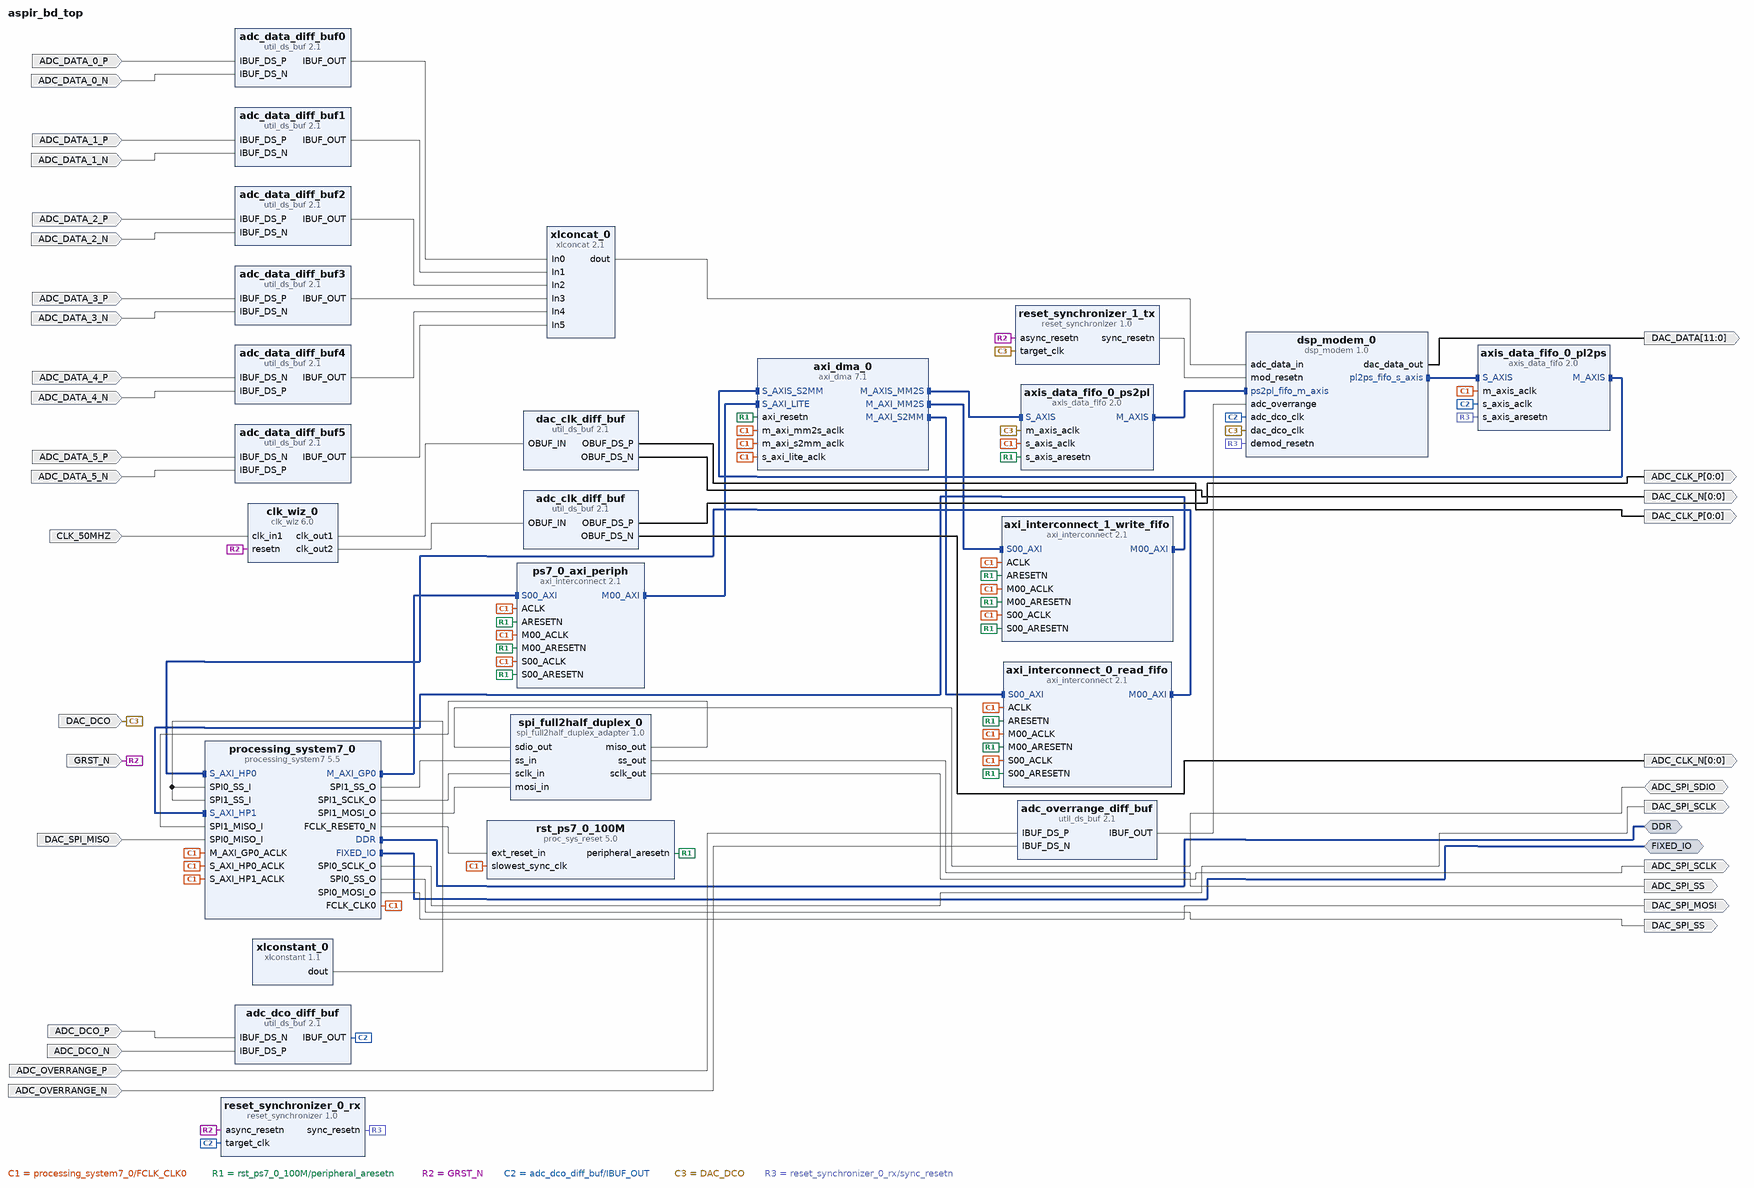
[diagram p0: block diagram of the top level]
# Vivado block design aspir_bd_top, xc7z020clg400-2, Vivado 2019.1
create_bd_design aspir_bd_top

create_bd_intf_port -mode Master -vlnv xilinx.com:interface:ddrx_rtl:1.0 DDR
create_bd_intf_port -mode Master -vlnv xilinx.com:display_processing_system7:fixedio_rtl:1.0 FIXED_IO
create_bd_port -dir O -type clk DAC_SPI_SCLK
create_bd_port -dir O DAC_SPI_SS
create_bd_port -dir O -type data DAC_SPI_MOSI
create_bd_port -dir I -type data DAC_SPI_MISO
create_bd_port -dir O -type clk ADC_SPI_SCLK
create_bd_port -dir O ADC_SPI_SS
create_bd_port -dir IO -type data ADC_SPI_SDIO
create_bd_port -dir I -type data ADC_OVERRANGE_P
create_bd_port -dir I -type data ADC_OVERRANGE_N
create_bd_port -dir I -type rst GRST_N
create_bd_port -dir I -type clk ADC_DCO_P
set_property -dict {CONFIG.FREQ_HZ 250000000} [get_bd_ports ADC_DCO_P]
create_bd_port -dir I -type clk ADC_DCO_N
set_property -dict {CONFIG.FREQ_HZ 250000000} [get_bd_ports ADC_DCO_N]
create_bd_port -dir I -type clk CLK_50MHZ
set_property -dict {CONFIG.ASSOCIATED_RESET GRST_N CONFIG.FREQ_HZ 50000000} [get_bd_ports CLK_50MHZ]
create_bd_port -dir O -from 0 -to 0 -type clk ADC_CLK_P
create_bd_port -dir O -from 0 -to 0 -type clk ADC_CLK_N
create_bd_port -dir O -from 0 -to 0 -type clk DAC_CLK_N
create_bd_port -dir O -from 0 -to 0 -type clk DAC_CLK_P
create_bd_port -dir O -from 11 -to 0 -type data DAC_DATA
create_bd_port -dir I -type clk DAC_DCO
set_property -dict {CONFIG.FREQ_HZ 250000000} [get_bd_ports DAC_DCO]
create_bd_port -dir I -type data ADC_DATA_0_P
create_bd_port -dir I -type data ADC_DATA_0_N
create_bd_port -dir I -type data ADC_DATA_1_P
create_bd_port -dir I -type data ADC_DATA_2_P
create_bd_port -dir I -type data ADC_DATA_3_P
create_bd_port -dir I -type data ADC_DATA_4_P
create_bd_port -dir I -type data ADC_DATA_5_P
create_bd_port -dir I -type data ADC_DATA_1_N
create_bd_port -dir I -type data ADC_DATA_2_N
create_bd_port -dir I -type data ADC_DATA_3_N
create_bd_port -dir I -type data ADC_DATA_4_N
create_bd_port -dir I -type data ADC_DATA_5_N

create_bd_cell -type ip -vlnv xilinx.com:ip:processing_system7:5.5 processing_system7_0
set_property -dict [list \
  CONFIG.PCW_APU_PERIPHERAL_FREQMHZ 767 \
  CONFIG.PCW_ENET0_ENET0_IO {MIO 16 .. 27} \
  CONFIG.PCW_ENET0_GRP_MDIO_ENABLE 1 \
  CONFIG.PCW_ENET0_GRP_MDIO_IO {MIO 52 .. 53} \
  CONFIG.PCW_ENET0_PERIPHERAL_ENABLE 1 \
  CONFIG.PCW_ENET0_RESET_ENABLE 1 \
  CONFIG.PCW_ENET0_RESET_IO {MIO 7} \
  CONFIG.PCW_ENET_RESET_ENABLE 1 \
  CONFIG.PCW_ENET_RESET_SELECT {Share reset pin} \
  CONFIG.PCW_FCLK_CLK0_BUF FALSE \
  CONFIG.PCW_FPGA0_PERIPHERAL_FREQMHZ 100 \
  CONFIG.PCW_GPIO_EMIO_GPIO_ENABLE 1 \
  CONFIG.PCW_GPIO_EMIO_GPIO_IO 3 \
  CONFIG.PCW_GPIO_EMIO_GPIO_WIDTH 3 \
  CONFIG.PCW_GPIO_MIO_GPIO_ENABLE 1 \
  CONFIG.PCW_GPIO_MIO_GPIO_IO MIO \
  CONFIG.PCW_I2C_RESET_ENABLE 0 \
  CONFIG.PCW_PRESET_BANK1_VOLTAGE {LVCMOS 1.8V} \
  CONFIG.PCW_QSPI_GRP_FBCLK_ENABLE 1 \
  CONFIG.PCW_QSPI_GRP_FBCLK_IO {MIO 8} \
  CONFIG.PCW_QSPI_GRP_SINGLE_SS_ENABLE 1 \
  CONFIG.PCW_QSPI_GRP_SINGLE_SS_IO {MIO 1 .. 6} \
  CONFIG.PCW_QSPI_PERIPHERAL_ENABLE 1 \
  CONFIG.PCW_QSPI_QSPI_IO {MIO 1 .. 6} \
  CONFIG.PCW_SD0_PERIPHERAL_ENABLE 0 \
  CONFIG.PCW_SINGLE_QSPI_DATA_MODE x4 \
  CONFIG.PCW_SPI0_PERIPHERAL_ENABLE 1 \
  CONFIG.PCW_SPI0_SPI0_IO EMIO \
  CONFIG.PCW_SPI1_PERIPHERAL_ENABLE 1 \
  CONFIG.PCW_SPI1_SPI1_IO EMIO \
  CONFIG.PCW_S_AXI_HP0_DATA_WIDTH 32 \
  CONFIG.PCW_UART0_PERIPHERAL_ENABLE 1 \
  CONFIG.PCW_UART0_UART0_IO {MIO 46 .. 47} \
  CONFIG.PCW_UART1_PERIPHERAL_ENABLE 0 \
  CONFIG.PCW_UART_PERIPHERAL_FREQMHZ 100 \
  CONFIG.PCW_UIPARAM_DDR_FREQ_MHZ 533.333 \
  CONFIG.PCW_UIPARAM_DDR_PARTNO {MT41J128M8 JP-125} \
  CONFIG.PCW_USB0_PERIPHERAL_ENABLE 0 \
  CONFIG.PCW_USB_RESET_ENABLE 1 \
  CONFIG.PCW_USE_S_AXI_HP0 1 \
  CONFIG.PCW_USE_S_AXI_HP1 1 \
] [get_bd_cells processing_system7_0]
# 255 more settings of processing_system7_0 are not shown: defaults, MIO pin electricals, DDR timing, and values the tool derives
create_bd_cell -type ip -vlnv xilinx.com:ip:clk_wiz:6.0 clk_wiz_0
set_property -dict [list \
  CONFIG.CLKIN1_JITTER_PS 200.0 \
  CONFIG.CLKOUT1_DRIVES BUFG \
  CONFIG.CLKOUT1_JITTER 136.987 \
  CONFIG.CLKOUT1_PHASE_ERROR 164.985 \
  CONFIG.CLKOUT1_REQUESTED_OUT_FREQ 250.000 \
  CONFIG.CLKOUT2_DRIVES BUFG \
  CONFIG.CLKOUT2_JITTER 136.987 \
  CONFIG.CLKOUT2_PHASE_ERROR 164.985 \
  CONFIG.CLKOUT2_REQUESTED_OUT_FREQ 250.000 \
  CONFIG.CLKOUT2_USED true \
  CONFIG.CLKOUT3_DRIVES BUFG \
  CONFIG.CLKOUT4_DRIVES BUFG \
  CONFIG.CLKOUT5_DRIVES BUFG \
  CONFIG.CLKOUT6_DRIVES BUFG \
  CONFIG.CLKOUT7_DRIVES BUFG \
  CONFIG.FEEDBACK_SOURCE FDBK_AUTO \
  CONFIG.MMCM_BANDWIDTH OPTIMIZED \
  CONFIG.MMCM_CLKFBOUT_MULT_F 20.000 \
  CONFIG.MMCM_CLKIN1_PERIOD 20.000 \
  CONFIG.MMCM_CLKIN2_PERIOD 10.0 \
  CONFIG.MMCM_CLKOUT0_DIVIDE_F 4.000 \
  CONFIG.MMCM_CLKOUT1_DIVIDE 4 \
  CONFIG.MMCM_COMPENSATION ZHOLD \
  CONFIG.NUM_OUT_CLKS 2 \
  CONFIG.PRIMITIVE MMCM \
  CONFIG.PRIM_IN_FREQ 50 \
  CONFIG.RESET_PORT resetn \
  CONFIG.RESET_TYPE ACTIVE_LOW \
] [get_bd_cells clk_wiz_0]
create_bd_cell -type ip -vlnv xilinx.com:ip:util_ds_buf:2.1 adc_overrange_diff_buf
create_bd_cell -type ip -vlnv xilinx.com:ip:util_ds_buf:2.1 adc_dco_diff_buf
create_bd_cell -type ip -vlnv xilinx.com:ip:util_ds_buf:2.1 dac_clk_diff_buf
set_property -dict {CONFIG.C_BUF_TYPE OBUFDS} [get_bd_cells dac_clk_diff_buf]
create_bd_cell -type ip -vlnv xilinx.com:ip:util_ds_buf:2.1 adc_clk_diff_buf
set_property -dict {CONFIG.C_BUF_TYPE OBUFDS} [get_bd_cells adc_clk_diff_buf]
create_bd_cell -type ip -vlnv xilinx.com:ip:util_ds_buf:2.1 adc_data_diff_buf1
set_property -dict {CONFIG.C_SIZE 1} [get_bd_cells adc_data_diff_buf1]
create_bd_cell -type ip -vlnv xilinx.com:ip:util_ds_buf:2.1 adc_data_diff_buf2
set_property -dict {CONFIG.C_SIZE 1} [get_bd_cells adc_data_diff_buf2]
create_bd_cell -type ip -vlnv xilinx.com:ip:util_ds_buf:2.1 adc_data_diff_buf3
set_property -dict {CONFIG.C_SIZE 1} [get_bd_cells adc_data_diff_buf3]
create_bd_cell -type ip -vlnv xilinx.com:ip:util_ds_buf:2.1 adc_data_diff_buf4
set_property -dict {CONFIG.C_SIZE 1} [get_bd_cells adc_data_diff_buf4]
create_bd_cell -type ip -vlnv xilinx.com:ip:util_ds_buf:2.1 adc_data_diff_buf5
set_property -dict {CONFIG.C_SIZE 1} [get_bd_cells adc_data_diff_buf5]
create_bd_cell -type ip -vlnv xilinx.com:ip:xlconcat:2.1 xlconcat_0
set_property -dict {CONFIG.NUM_PORTS 6} [get_bd_cells xlconcat_0]
create_bd_cell -type ip -vlnv xilinx.com:ip:util_ds_buf:2.1 adc_data_diff_buf0
set_property -dict {CONFIG.C_SIZE 1} [get_bd_cells adc_data_diff_buf0]
create_bd_cell -type ip -vlnv xilinx.com:ip:axi_dma:7.1 axi_dma_0
set_property -dict {CONFIG.c_include_sg 0} [get_bd_cells axi_dma_0]
create_bd_cell -type ip -vlnv xilinx.com:ip:axis_data_fifo:2.0 axis_data_fifo_0_ps2pl
set_property -dict [list \
  CONFIG.FIFO_MEMORY_TYPE block \
  CONFIG.HAS_TKEEP 1 \
  CONFIG.HAS_TLAST 1 \
  CONFIG.HAS_TSTRB 0 \
  CONFIG.IS_ACLK_ASYNC 1 \
  CONFIG.TDATA_NUM_BYTES 4 \
  CONFIG.TDEST_WIDTH 0 \
  CONFIG.TID_WIDTH 0 \
  CONFIG.TUSER_WIDTH 0 \
] [get_bd_cells axis_data_fifo_0_ps2pl]
create_bd_cell -type ip -vlnv xilinx.com:ip:proc_sys_reset:5.0 rst_ps7_0_100M
create_bd_cell -type ip -vlnv xilinx.com:ip:axi_interconnect:2.1 ps7_0_axi_periph
set_property -dict {CONFIG.NUM_MI 1} [get_bd_cells ps7_0_axi_periph]
create_bd_cell -type ip -vlnv xilinx.com:ip:axis_data_fifo:2.0 axis_data_fifo_0_pl2ps
set_property -dict [list \
  CONFIG.FIFO_MEMORY_TYPE block \
  CONFIG.HAS_TKEEP 1 \
  CONFIG.HAS_TLAST 1 \
  CONFIG.HAS_TSTRB 0 \
  CONFIG.IS_ACLK_ASYNC 1 \
  CONFIG.TDATA_NUM_BYTES 4 \
  CONFIG.TDEST_WIDTH 0 \
  CONFIG.TID_WIDTH 0 \
  CONFIG.TUSER_WIDTH 0 \
] [get_bd_cells axis_data_fifo_0_pl2ps]
create_bd_cell -type ip -vlnv xilinx.com:ip:xlconstant:1.1 xlconstant_0
create_bd_cell -type ip -vlnv xilinx.com:user:reset_synchronizer:1.0 reset_synchronizer_0_rx
create_bd_cell -type ip -vlnv xilinx.com:user:reset_synchronizer:1.0 reset_synchronizer_1_tx
create_bd_cell -type ip -vlnv xilinx.com:ip:axi_interconnect:2.1 axi_interconnect_0_read_fifo
set_property -dict [list \
  CONFIG.NUM_MI 1 \
  CONFIG.NUM_SI 1 \
  CONFIG.S00_HAS_DATA_FIFO 2 \
  CONFIG.S01_HAS_DATA_FIFO 2 \
  CONFIG.S02_HAS_DATA_FIFO 2 \
  CONFIG.STRATEGY 0 \
] [get_bd_cells axi_interconnect_0_read_fifo]
create_bd_cell -type ip -vlnv xilinx.com:ip:axi_interconnect:2.1 axi_interconnect_1_write_fifo
set_property -dict {CONFIG.NUM_MI 1} [get_bd_cells axi_interconnect_1_write_fifo]
create_bd_cell -type ip -vlnv xilinx.com:user:spi_full2half_duplex_adapter:1.0 spi_full2half_duplex_0
create_bd_cell -type ip -vlnv xilinx.com:user:dsp_modem:1.0 dsp_modem_0

# ---- connections ----

connect_bd_intf_net [get_bd_intf_pins axi_dma_0/M_AXIS_MM2S] [get_bd_intf_pins axis_data_fifo_0_ps2pl/S_AXIS]
connect_bd_intf_net [get_bd_intf_pins axis_data_fifo_0_pl2ps/M_AXIS] [get_bd_intf_pins axi_dma_0/S_AXIS_S2MM]
connect_bd_intf_net [get_bd_intf_pins processing_system7_0/M_AXI_GP0] [get_bd_intf_pins ps7_0_axi_periph/S00_AXI]
connect_bd_intf_net [get_bd_intf_pins dsp_modem_0/ps2pl_fifo_m_axis] [get_bd_intf_pins axis_data_fifo_0_ps2pl/M_AXIS]
connect_bd_intf_net [get_bd_intf_pins axi_dma_0/M_AXI_S2MM] [get_bd_intf_pins axi_interconnect_0_read_fifo/S00_AXI]
connect_bd_intf_net -intf_net axi_interconnect_0_read_M00_AXI [get_bd_intf_pins processing_system7_0/S_AXI_HP0] [get_bd_intf_pins axi_interconnect_0_read_fifo/M00_AXI]
connect_bd_intf_net [get_bd_intf_ports DDR] [get_bd_intf_pins processing_system7_0/DDR]
connect_bd_intf_net [get_bd_intf_pins dsp_modem_0/pl2ps_fifo_s_axis] [get_bd_intf_pins axis_data_fifo_0_pl2ps/S_AXIS]
connect_bd_intf_net [get_bd_intf_ports FIXED_IO] [get_bd_intf_pins processing_system7_0/FIXED_IO]
connect_bd_intf_net [get_bd_intf_pins ps7_0_axi_periph/M00_AXI] [get_bd_intf_pins axi_dma_0/S_AXI_LITE]
connect_bd_intf_net -intf_net axi_interconnect_1_write_M00_AXI [get_bd_intf_pins processing_system7_0/S_AXI_HP1] [get_bd_intf_pins axi_interconnect_1_write_fifo/M00_AXI]
connect_bd_intf_net [get_bd_intf_pins axi_dma_0/M_AXI_MM2S] [get_bd_intf_pins axi_interconnect_1_write_fifo/S00_AXI]
connect_bd_net [get_bd_pins processing_system7_0/FCLK_CLK0] \
  [get_bd_pins processing_system7_0/S_AXI_HP0_ACLK] [get_bd_pins processing_system7_0/M_AXI_GP0_ACLK] \
  [get_bd_pins rst_ps7_0_100M/slowest_sync_clk] [get_bd_pins ps7_0_axi_periph/S00_ACLK] \
  [get_bd_pins axi_dma_0/s_axi_lite_aclk] [get_bd_pins ps7_0_axi_periph/M00_ACLK] [get_bd_pins ps7_0_axi_periph/ACLK] \
  [get_bd_pins axi_dma_0/m_axi_mm2s_aclk] [get_bd_pins axi_dma_0/m_axi_s2mm_aclk] \
  [get_bd_pins axis_data_fifo_0_pl2ps/m_axis_aclk] [get_bd_pins axis_data_fifo_0_ps2pl/s_axis_aclk] \
  [get_bd_pins axi_interconnect_1_write_fifo/ACLK] [get_bd_pins axi_interconnect_0_read_fifo/ACLK] \
  [get_bd_pins axi_interconnect_0_read_fifo/S00_ACLK] [get_bd_pins axi_interconnect_0_read_fifo/M00_ACLK] \
  [get_bd_pins axi_interconnect_1_write_fifo/S00_ACLK] [get_bd_pins axi_interconnect_1_write_fifo/M00_ACLK] \
  [get_bd_pins processing_system7_0/S_AXI_HP1_ACLK]
connect_bd_net [get_bd_pins processing_system7_0/SPI0_SCLK_O] [get_bd_ports DAC_SPI_SCLK]
connect_bd_net [get_bd_pins processing_system7_0/SPI0_SS_O] [get_bd_ports DAC_SPI_SS]
connect_bd_net [get_bd_pins processing_system7_0/SPI0_MOSI_O] [get_bd_ports DAC_SPI_MOSI]
connect_bd_net [get_bd_ports DAC_SPI_MISO] [get_bd_pins processing_system7_0/SPI0_MISO_I]
connect_bd_net [get_bd_ports ADC_OVERRANGE_P] [get_bd_pins adc_overrange_diff_buf/IBUF_DS_P]
connect_bd_net [get_bd_ports ADC_OVERRANGE_N] [get_bd_pins adc_overrange_diff_buf/IBUF_DS_N]
connect_bd_net [get_bd_ports CLK_50MHZ] [get_bd_pins clk_wiz_0/clk_in1]
connect_bd_net [get_bd_pins clk_wiz_0/clk_out1] [get_bd_pins dac_clk_diff_buf/OBUF_IN]
connect_bd_net [get_bd_pins clk_wiz_0/clk_out2] [get_bd_pins adc_clk_diff_buf/OBUF_IN]
connect_bd_net [get_bd_pins dac_clk_diff_buf/OBUF_DS_P] [get_bd_ports DAC_CLK_P]
connect_bd_net [get_bd_pins dac_clk_diff_buf/OBUF_DS_N] [get_bd_ports DAC_CLK_N]
connect_bd_net [get_bd_pins adc_clk_diff_buf/OBUF_DS_P] [get_bd_ports ADC_CLK_P]
connect_bd_net [get_bd_pins adc_clk_diff_buf/OBUF_DS_N] [get_bd_ports ADC_CLK_N]
connect_bd_net [get_bd_ports ADC_DATA_0_P] [get_bd_pins adc_data_diff_buf0/IBUF_DS_P]
connect_bd_net [get_bd_ports ADC_DATA_0_N] [get_bd_pins adc_data_diff_buf0/IBUF_DS_N]
connect_bd_net [get_bd_ports ADC_DATA_1_P] [get_bd_pins adc_data_diff_buf1/IBUF_DS_P]
connect_bd_net [get_bd_ports ADC_DATA_1_N] [get_bd_pins adc_data_diff_buf1/IBUF_DS_N]
connect_bd_net [get_bd_ports ADC_DATA_2_P] [get_bd_pins adc_data_diff_buf2/IBUF_DS_P]
connect_bd_net [get_bd_ports ADC_DATA_2_N] [get_bd_pins adc_data_diff_buf2/IBUF_DS_N]
connect_bd_net [get_bd_ports ADC_DATA_3_P] [get_bd_pins adc_data_diff_buf3/IBUF_DS_P]
connect_bd_net [get_bd_ports ADC_DATA_3_N] [get_bd_pins adc_data_diff_buf3/IBUF_DS_N]
connect_bd_net [get_bd_ports ADC_DATA_4_P] [get_bd_pins adc_data_diff_buf4/IBUF_DS_N]
connect_bd_net [get_bd_ports ADC_DATA_4_N] [get_bd_pins adc_data_diff_buf4/IBUF_DS_P]
connect_bd_net [get_bd_ports ADC_DATA_5_P] [get_bd_pins adc_data_diff_buf5/IBUF_DS_N]
connect_bd_net [get_bd_ports ADC_DATA_5_N] [get_bd_pins adc_data_diff_buf5/IBUF_DS_P]
connect_bd_net [get_bd_ports ADC_DCO_P] [get_bd_pins adc_dco_diff_buf/IBUF_DS_N]
connect_bd_net [get_bd_ports ADC_DCO_N] [get_bd_pins adc_dco_diff_buf/IBUF_DS_P]
connect_bd_net [get_bd_pins adc_data_diff_buf0/IBUF_OUT] [get_bd_pins xlconcat_0/In0]
connect_bd_net [get_bd_pins adc_data_diff_buf1/IBUF_OUT] [get_bd_pins xlconcat_0/In1]
connect_bd_net [get_bd_pins adc_data_diff_buf2/IBUF_OUT] [get_bd_pins xlconcat_0/In2]
connect_bd_net [get_bd_pins adc_data_diff_buf3/IBUF_OUT] [get_bd_pins xlconcat_0/In3]
connect_bd_net [get_bd_pins adc_data_diff_buf4/IBUF_OUT] [get_bd_pins xlconcat_0/In4]
connect_bd_net [get_bd_pins adc_data_diff_buf5/IBUF_OUT] [get_bd_pins xlconcat_0/In5]
connect_bd_net [get_bd_pins processing_system7_0/FCLK_RESET0_N] [get_bd_pins rst_ps7_0_100M/ext_reset_in]
connect_bd_net [get_bd_pins rst_ps7_0_100M/peripheral_aresetn] \
  [get_bd_pins ps7_0_axi_periph/S00_ARESETN] [get_bd_pins axi_dma_0/axi_resetn] [get_bd_pins ps7_0_axi_periph/M00_ARESETN] \
  [get_bd_pins ps7_0_axi_periph/ARESETN] [get_bd_pins axis_data_fifo_0_ps2pl/s_axis_aresetn] \
  [get_bd_pins axi_interconnect_0_read_fifo/ARESETN] [get_bd_pins axi_interconnect_0_read_fifo/S00_ARESETN] \
  [get_bd_pins axi_interconnect_0_read_fifo/M00_ARESETN] [get_bd_pins axi_interconnect_1_write_fifo/S00_ARESETN] \
  [get_bd_pins axi_interconnect_1_write_fifo/M00_ARESETN] [get_bd_pins axi_interconnect_1_write_fifo/ARESETN]
connect_bd_net -net GRST_B_1 [get_bd_ports GRST_N] \
  [get_bd_pins clk_wiz_0/resetn] [get_bd_pins reset_synchronizer_0_rx/async_resetn] \
  [get_bd_pins reset_synchronizer_1_tx/async_resetn]
connect_bd_net [get_bd_pins adc_dco_diff_buf/IBUF_OUT] \
  [get_bd_pins axis_data_fifo_0_pl2ps/s_axis_aclk] [get_bd_pins reset_synchronizer_0_rx/target_clk] \
  [get_bd_pins dsp_modem_0/adc_dco_clk]
connect_bd_net [get_bd_ports DAC_DCO] \
  [get_bd_pins axis_data_fifo_0_ps2pl/m_axis_aclk] [get_bd_pins reset_synchronizer_1_tx/target_clk] \
  [get_bd_pins dsp_modem_0/dac_dco_clk]
connect_bd_net [get_bd_pins xlconstant_0/dout] [get_bd_pins processing_system7_0/SPI0_SS_I] [get_bd_pins processing_system7_0/SPI1_SS_I]
connect_bd_net [get_bd_pins reset_synchronizer_0_rx/sync_resetn] \
  [get_bd_pins axis_data_fifo_0_pl2ps/s_axis_aresetn] [get_bd_pins dsp_modem_0/demod_resetn]
connect_bd_net [get_bd_pins reset_synchronizer_1_tx/sync_resetn] [get_bd_pins dsp_modem_0/mod_resetn]
connect_bd_net [get_bd_pins adc_overrange_diff_buf/IBUF_OUT] [get_bd_pins dsp_modem_0/adc_overrange]
connect_bd_net [get_bd_pins xlconcat_0/dout] [get_bd_pins dsp_modem_0/adc_data_in]
connect_bd_net [get_bd_pins dsp_modem_0/dac_data_out] [get_bd_ports DAC_DATA]
connect_bd_net [get_bd_ports ADC_SPI_SDIO] [get_bd_pins spi_full2half_duplex_0/sdio_out]
connect_bd_net [get_bd_pins spi_full2half_duplex_0/ss_out] [get_bd_ports ADC_SPI_SS]
connect_bd_net [get_bd_pins spi_full2half_duplex_0/sclk_out] [get_bd_ports ADC_SPI_SCLK]
connect_bd_net [get_bd_pins processing_system7_0/SPI1_SS_O] [get_bd_pins spi_full2half_duplex_0/ss_in]
connect_bd_net [get_bd_pins processing_system7_0/SPI1_SCLK_O] [get_bd_pins spi_full2half_duplex_0/sclk_in]
connect_bd_net [get_bd_pins processing_system7_0/SPI1_MOSI_O] [get_bd_pins spi_full2half_duplex_0/mosi_in]
connect_bd_net [get_bd_pins spi_full2half_duplex_0/miso_out] [get_bd_pins processing_system7_0/SPI1_MISO_I]

# ---- address map ----
assign_bd_address -offset 0x00000000 -range 512M -target_address_space [get_bd_addr_spaces axi_dma_0/Data_MM2S] [get_bd_addr_segs processing_system7_0/S_AXI_HP1/HP1_DDR_LOWOCM]
assign_bd_address -offset 0x00000000 -range 512M -target_address_space [get_bd_addr_spaces axi_dma_0/Data_S2MM] [get_bd_addr_segs processing_system7_0/S_AXI_HP0/HP0_DDR_LOWOCM]
assign_bd_address -offset 0x40400000 -range 64K -target_address_space [get_bd_addr_spaces processing_system7_0/Data] [get_bd_addr_segs axi_dma_0/S_AXI_LITE/Reg]

validate_bd_design
save_bd_design
